# Altium schematic sheet Ethernet.SchDoc
size A3
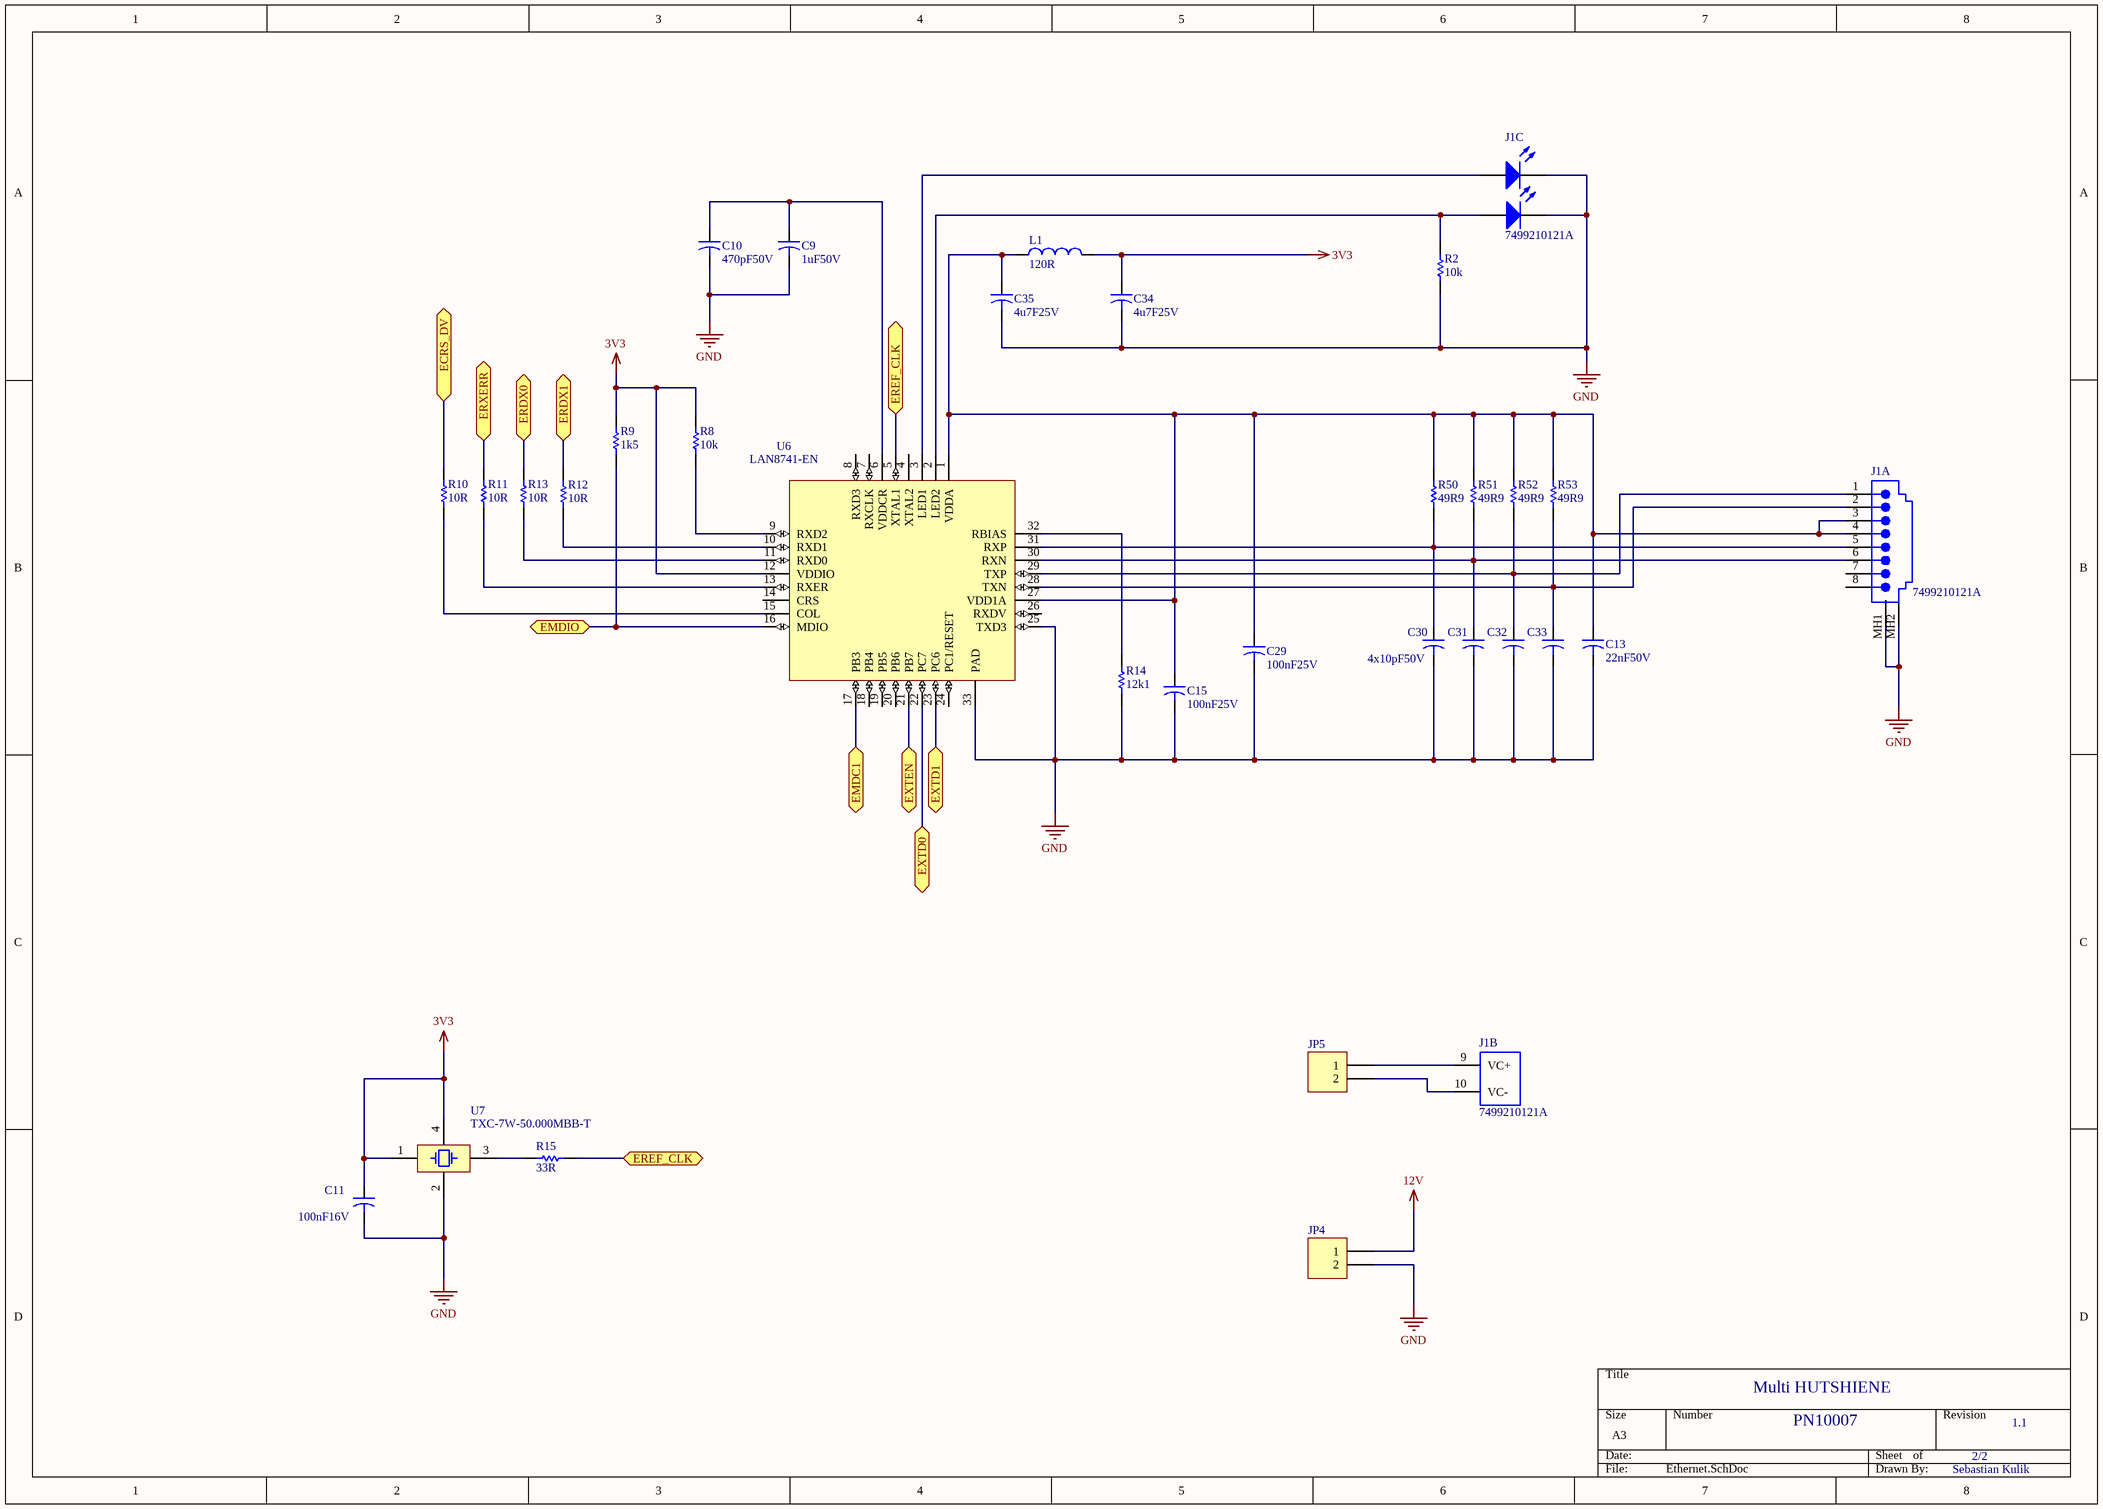
[diagram p0: Ethernet.SchDoc]

## Parts
C9  value 1uF50V  [C0603]  (hidden comment: 1uF50V_0603)
C10  value 470pF50V  [C0402]  (hidden comment: 470pF50V_0402)
C11  value 100nF16V  [C0402]  (hidden comment: 100nF16V_0402)
C13  value 22nF50V  [C0603]  (hidden comment: 22nF50V_0603)
C15  value 100nF25V  [C0402]  (hidden comment: 100nF25V_0402)
C29  value 100nF25V  [C0402]  (hidden comment: 100nF25V_0402)
C30  10pF50V_0603  [C0603]  (value not drawn)
C31  10pF50V_0603  [C0603]  (value not drawn)
C32  10pF50V_0603  [C0603]  (value not drawn)
C33  10pF50V_0603  [C0603]  (value not drawn)
C34  value 4u7F25V  [C0805]  (hidden comment: 4u7F25V_0805)
C35  value 4u7F25V  [C0805]  (hidden comment: 4u7F25V_0805)
J1  7499210121A  [7499210121A]  (parts A,B,C of 3)
JP4  Header-2  [HDR1X2]  (value not drawn)
JP5  Header-2  [HDR1X2]  (value not drawn)
L1  value 120R  [L0603]  (hidden comment: 120R4A_0603)
R2  value 10k  [R0402]  (hidden comment: 10k_0402)
R8  value 10k  [R0402]  (hidden comment: 10k_0402)
R9  value 1k5  [R0402]  (hidden comment: 1k5_0402)
R10  value 10R  [R0402]  (hidden comment: 10R_0402)
R11  value 10R  [R0402]  (hidden comment: 10R_0402)
R12  value 10R  [R0402]  (hidden comment: 10R_0402)
R13  value 10R  [R0402]  (hidden comment: 10R_0402)
R14  value 12k1  [R0603(1608)]  (hidden comment: 12k1_0603)
R15  value 33R  [R0402]  (hidden comment: 33R_0402)
R50  value 49R9  [R0402]  (hidden comment: 49R9_0402)
R51  value 49R9  [R0402]  (hidden comment: 49R9_0402)
R52  value 49R9  [R0402]  (hidden comment: 49R9_0402)
R53  value 49R9  [R0402]  (hidden comment: 49R9_0402)
U6  LAN8741-EN  [32M1-A_M]
U7  TXC-7W-50.000MBB-T  [TXC_7W]

## Ports
ECRS_DV, EMDC1, EMDIO, ERDX0, ERDX1, EREF_CLK, ERXERR, EXTD0, EXTD1, EXTEN

## Nets
3V3: C11.1 C34.1 L1.2 R8.2 R9.2 U6.12(VDDIO) U7.1(E/D) U7.4(VCC)
12V: JP4.1
GND: C9.2 C10.2 C11.2 C13.2 C15.2 C29.2 C30.2 C31.2 C32.2 C33.2 C34.2 C35.2 J1.12(K) J1.14(K) J1.MH1(Shield) J1.MH2(Shield) JP4.2 R2.1 R14.1 U6.25(TXD3) U6.33(PAD) U7.2(GND)
ECRS_DV: R10.2 ; port ECRS_DV
EMDC1: U6.17(PB3) ; port EMDC1
EMDIO: R9.1 U6.16(MDIO) ; port EMDIO
ERDX0: R13.2 ; port ERDX0
ERDX1: R12.1 ; port ERDX1
EREF_CLK: R15.2 U6.5(XTAL1) ; port EREF_CLK
ERXERR: R11.2 ; port ERXERR
EXTD0: U6.22(PC7) ; port EXTD0
EXTD1: U6.23(PC6) ; port EXTD1
EXTEN: U6.21(PB7) ; port EXTEN
NetC9_1: C9.1 C10.1 U6.6(VDDCR)
NetC13_1: C13.1 C15.1 C29.1 C35.1 J1.3 J1.4 L1.1 R50.2 R51.2 R52.2 R53.2 U6.1(VDDA) U6.27(VDD1A)
NetC30_1: C30.1 J1.5 R50.1 U6.31(RXP)
NetC31_1: C31.1 J1.6 R51.1 U6.30(RXN)
NetC32_1: C32.1 J1.1 R52.1 U6.29(TXP)
NetC33_1: C33.1 J1.2 R53.1 U6.28(TXN)
NetJ1_9: J1.9(VC+) JP5.1
NetJ1_10: J1.10(VC-) JP5.2
NetJ1_11: J1.11(A) U6.3(LED1)
NetJ1_13: J1.13(A) R2.2 U6.2(LED2)
NetR8_1: R8.1 U6.9(RXD2)
NetR10_1: R10.1 U6.15(COL)
NetR11_1: R11.1 U6.13(RXER)
NetR12_2: R12.2 U6.10(RXD1)
NetR13_1: R13.1 U6.11(RXD0)
NetR14_2: R14.2 U6.32(RBIAS)
NetR15_1: R15.1 U7.3(OSC2)

Not connected (* = marked no-connect by the designer): J1 7 8; U6 4(XTAL2) 7(RXCLK) 8(RXD3) 14(CRS) 18(PB4) 19(PB5) 20(PB6) 24(PC1/RESET) 26(RXDV)

## Notes on the sheet
- (near C30) 4x10pF50V
- Multi HUTSHIENE
- PN10007
- 2/2
- 1.1
- Sebastian Kulik

## Library data of the parts
C9 = 1uF50V_0603: C series, X5R, 10%; Deliverer PartNr: 2211179RL; Manufacturer: TDK; Manufacturer PartNr: C1608X5R1H105K080AB; Deliverer: Farnell; TDFE-PN: C0037; Published: 13.02.2014; Part Description: C series, X5R, 10%; Publisher: Sebastian Kulik; PackageDescription: C0603
C10 = 470pF50V_0402: AVX, 50V; Deliverer PartNr: 1657927; Manufacturer PartNr: 04025A471JAT2A; Deliverer: Farnell; TDFE-PN: C0030; Published: 13.02.2014; Part Description: AVX,50V; Publisher: Sebastian Kulik; PackageDescription: C0403; Manufacturer: AVX
C11 = 100nF16V_0402: Capacitor; Part Description: TDK. CGA series, X7R, 10%, 16V; Deliverer PartNr: 2210748RL; Manufacturer: TDK; Manufacturer PartNr: CGA2B1X7R1C104K050BC; Deliverer: Farnell; TDFE-PN: C0025; Published: 12.02.2014; Publisher: Sebastian Kulik; PackageDescription: C0403
C13 = 22nF50V_0603: AVX ,  X7R, 5%, 50V; Deliverer PartNr: 2332645RL; Manufacturer PartNr: 06035C223JAT2A; Deliverer: Farnell; TDFE-PN: C0034; Published: 13.02.2014; Part Description: AVX ,  X7R, 5%, 50V; Publisher: Sebastian Kulik; PackageDescription: C0603; Manufacturer: AVX
C15 C29 = 100nF25V_0402: AVX, X5R, 10%, 25V; Deliverer PartNr: 2280767; Manufacturer PartNr: 04023D104KAT2A; Deliverer: Farnell; TDFE-PN: C0036; Published: 13.02.2014; Part Description: AVX, X5R, 10%, 25V; Publisher: Sebastian Kulik; PackageDescription: C0403; Manufacturer: AVX
C30-C33 = 10pF50V_0603: AVX ,  +-0.5pF, 50V; Deliverer PartNr: 2332595RL; Manufacturer PartNr: 06035A100DAT2A; Deliverer: Farnell; TDFE-PN: C0033; Published: 13.02.2014; Part Description: AVX ,  +-0.5pF, 50V; Publisher: Sebastian Kulik; PackageDescription: C0603; Manufacturer: AVX; Value: 10pF50V
C34 C35 = 4u7F25V_0805: TDK  C series, X7R, 10%, 25V; Deliverer PartNr: 2346943RL; Manufacturer PartNr: C2012X7R1E475K125AB; Deliverer: Farnell; TDFE-PN: C0035; Published: 13.02.2014; Part Description: TDK  C series, X7R, 10%, 25V; Publisher: Sebastian Kulik; PackageDescription: C0805; Manufacturer: TDK
J1 = Ethernet, POE, WE7499210121A: Modular Jack , Right Angle RJ-45, Low Profile; Deliverer PartNr: 1636396; Manufacturer: Wuerth Elektronik; Ports: 1; PCB_Mounting: Thru-Hole; Deliverer: Farnell; TDE-PN: CON0005; PackageReference: 7499210121A; Publisher: Sebastian Kulik; Manufacturer PartNr: 7499210121A
JP4 JP5 = Header-2: Header, 5-Pin; LatestRevisionDate: 17-Jul-2002; LatestRevisionNote: Re-released for DXP Platform.; Publisher: Sebastian Kulik
L1 = 120R4A_0603: Murata, Ferrit, 120Rx2A; Deliverer PartNr: 1515738RL; Manufacturer PartNr: BLM18PG121SN1D; Deliverer: Farnell; TDE-PN: P0016; Manufacturer: Murata; Published: 13.02.2014; Publisher: Sebastian Kulik
R2 R8 = 10k_0402: Vishay CRCW series, 125mW, 1%; Manufacturer PartNr: CRCW040210K0FKEAHP; Deliverer PartNr: 1738864; TDE-PN: R0012; Deliverer: Farnell; Published: 12.02.2014; PackageReference: 0402; Publisher: Sebastian Kulik; PackageDescription: 0402; Manufacturer: Vishay; Part Description: Vishay CRCW series, 125mW, 1%
R9 = 1k5_0402: Vishay CRCW series, 125mW, 1%; Manufacturer PartNr: CRCW04021K50FKEAHP; Deliverer PartNr: 1738852; Part Description: Vishay CRCW series, 63mW, 1%; TDE-PN: R0036; Deliverer: Farnell; Published: 13.02.2014; PackageReference: 0402; Publisher: Sebastian Kulik; PackageDescription: 0402; Manufacturer: Vishay
R10-R13 = 10R_0402: Vishay CRCW series, 125mW, 1%; Manufacturer PartNr: CRCW040210R0FKEAHP; Deliverer PartNr: 1738824RL; TDE-PN: R0015; Deliverer: Farnell; Published: 12.02.2014; PackageReference: 0402; Publisher: Sebastian Kulik; PackageDescription: 0402; Manufacturer: Vishay; Part Description: Vishay CRCW series, 125mW, 1%
R14 = 12k1_0603: Vishay, CRCW series, 100mW, 1%; Manufacturer PartNr: CRCW060312K1FKEA; Deliverer PartNr: 2122502; TDE-PN: R0037; Deliverer: Farnell; Published: 11.02.2014; Publisher: Sebastian Kulik; PackageDescription: 0603; Manufacturer: Vishay; Part Desicription: Vishay, CRCW series, 100mW, 1%
R15 = 33R_0402: Vishay CRCW series, 63mW, 1%; Manufacturer PartNr: CRCW040233R0FKEAHP; Deliverer PartNr: 1738830; TDE-PN: R0037; Deliverer: Farnell; Published: 12.02.2014; PackageReference: 0402; Publisher: Sebastian Kulik; PackageDescription: 0402; Manufacturer: Vishay; Part Description: Vishay CRCW series, 63mW, 1%
R50-R53 = 49R9_0402: Vishay CRCW series, 63mW, 1%; Manufacturer PartNr: CRCW040249R9FKED; Deliverer PartNr: 2121437; TDE-PN: R0035; Deliverer: Farnell; Published: 13.02.2014; PackageReference: 0402; Publisher: Sebastian Kulik; PackageDescription: 0402; Manufacturer: Vishay; Part Description: Vishay CRCW series, 63mW, 1%
U6 = LAN8741-EN: Ethernet Phy; Deliverer PartNr: 2373284; Manufacturer PartNr: LAN8741A-EN; Manufacturer: Microchip; TDE-PN: IC0036; Deliverer: Farnell; Published: 12.02.2014; LatestRevisionNote: IPC-7351 Footprint Added.; Publisher: Sebastian Kulik
U7 = TXC-7W-50.000MBB-T: Crystal; Deliverer PartNr: 1842144; Manufacturer: TXC; Deliverer: Farnell; TDE-PN: IC0037; Published: 17.02.2014; PackageReference: SOT23; Publisher: Sebastian Kulik; Manufacturer PartNr: 7W-50.000MBB-T